# EAGLE design cartemoteur (EAGLE 7.6.0)
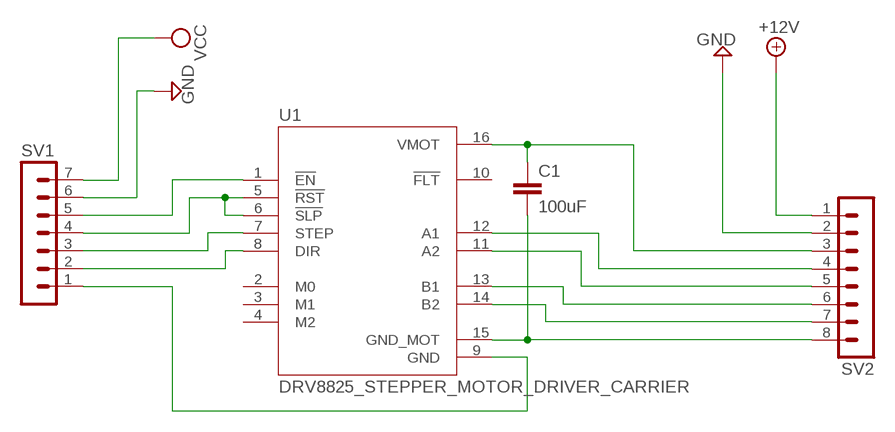
[diagram p0: schematic, sheet 1]

## Parts
C1  100uF  C-EU025-024X044  [C025-024X044]
SV1  MA07-1  [MA07-1]
SV2  MA08-1  [MA08-1]
U1  DRV8825_STEPPER_MOTOR_DRIVER_CARRIER  [IC_DRV8825_STEPPER_MOTOR_DRIVER_CARRIER]

## Nets
+12V: SV2.1
GND: SV1.6 SV2.2
N$1: SV1.5 U1.1(!EN)
N$2: SV1.4 U1.5(!RST) U1.6(!SLP)
N$3: SV1.3 U1.7(STEP)
N$4: SV1.2 U1.8(DIR)
N$5: SV1.1 U1.9(GND)
N$6: C1.2 SV2.8 U1.15(GND_MOT)
N$7: SV2.7 U1.14(B2)
N$8: SV2.6 U1.13(B1)
N$9: SV2.5 U1.11(A2)
N$10: SV2.4 U1.12(A1)
N$11: C1.1 SV2.3 U1.16(VMOT)
VCC: SV1.7
Unconnected: U1.2(M0) U1.3(M1) U1.4(M2) U1.10(!FLT)

## Library data of the parts
C1 = rcl:C-EU: CAPACITOR, European symbol
SV1 = con-lstb:MA07-1: PIN HEADER; OC_FARNELL: unknown; OC_NEWARK: unknown
SV2 = con-lstb:MA08-1: PIN HEADER; OC_FARNELL: unknown; OC_NEWARK: unknown
U1 = DRV8825_STEPPER_MOTOR_DRIVER_CARRIER:DRV8825_STEPPER_MOTOR_DRIVER_CARRIER: Stepper motor controler; IC: DRV8825; 1.5A; Uin mot: 8.2÷45V; AVAILABILITY: Unavailable; DESCRIPTION: DRV8825 Motor Controller/Driver Power Management Evaluation Board; MF: Pololu; MP: DRV8825 STEPPER MOTOR DRIVER CARRIER; PACKAGE: None; PRICE: None

## Board
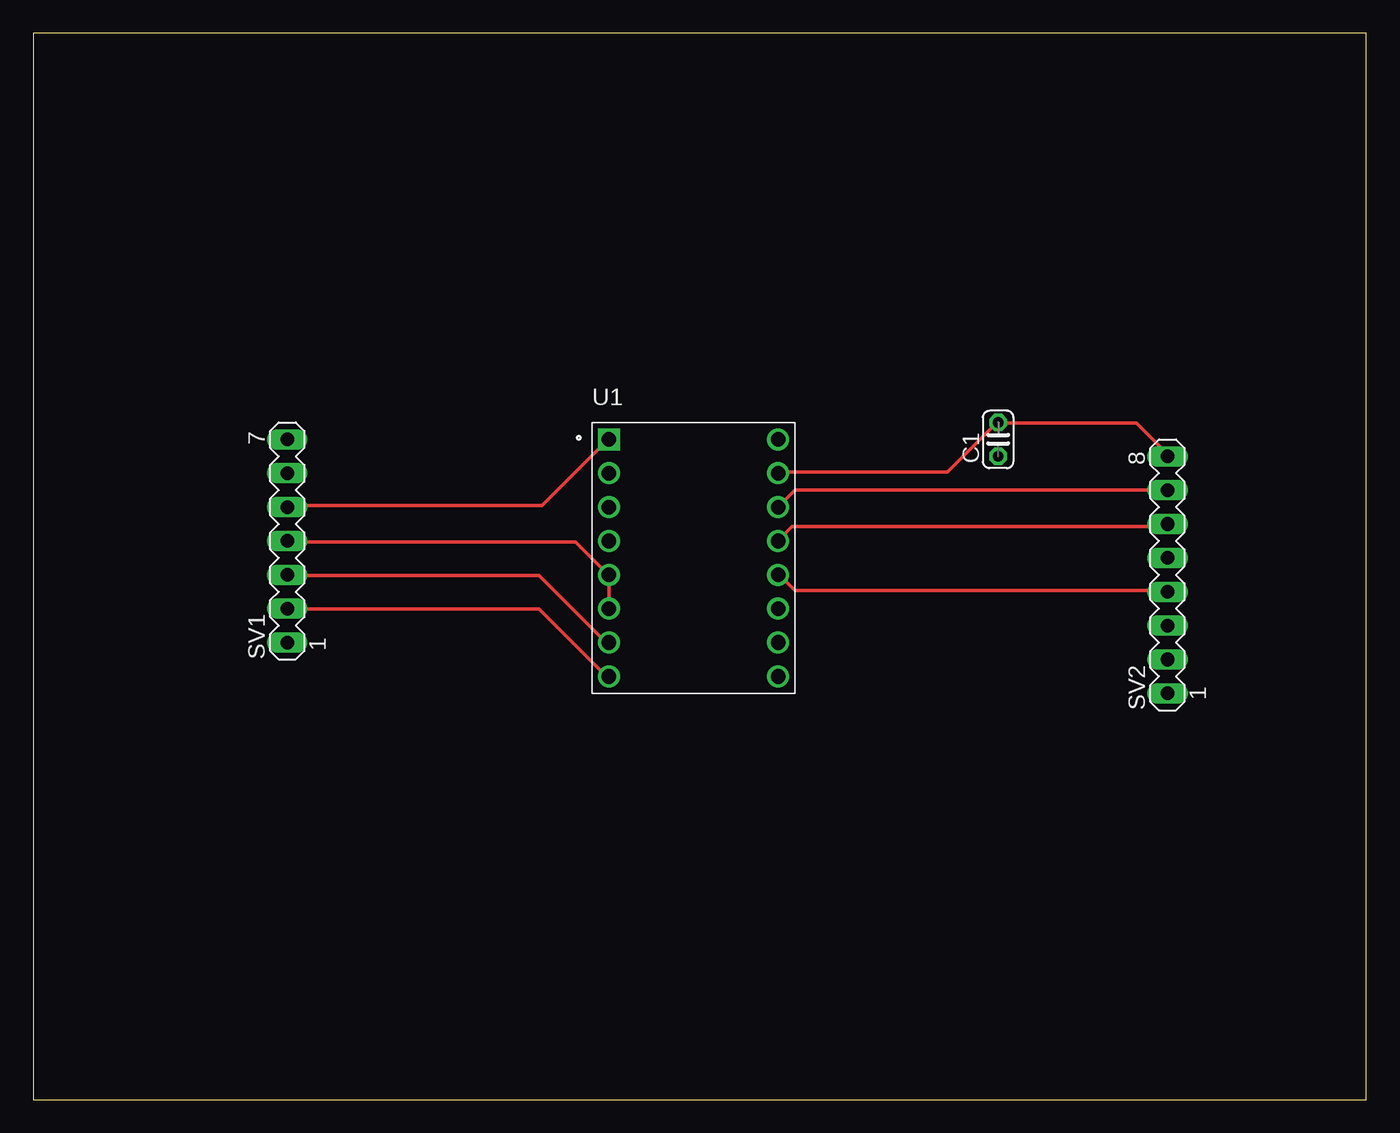
[diagram p1: board, top side]
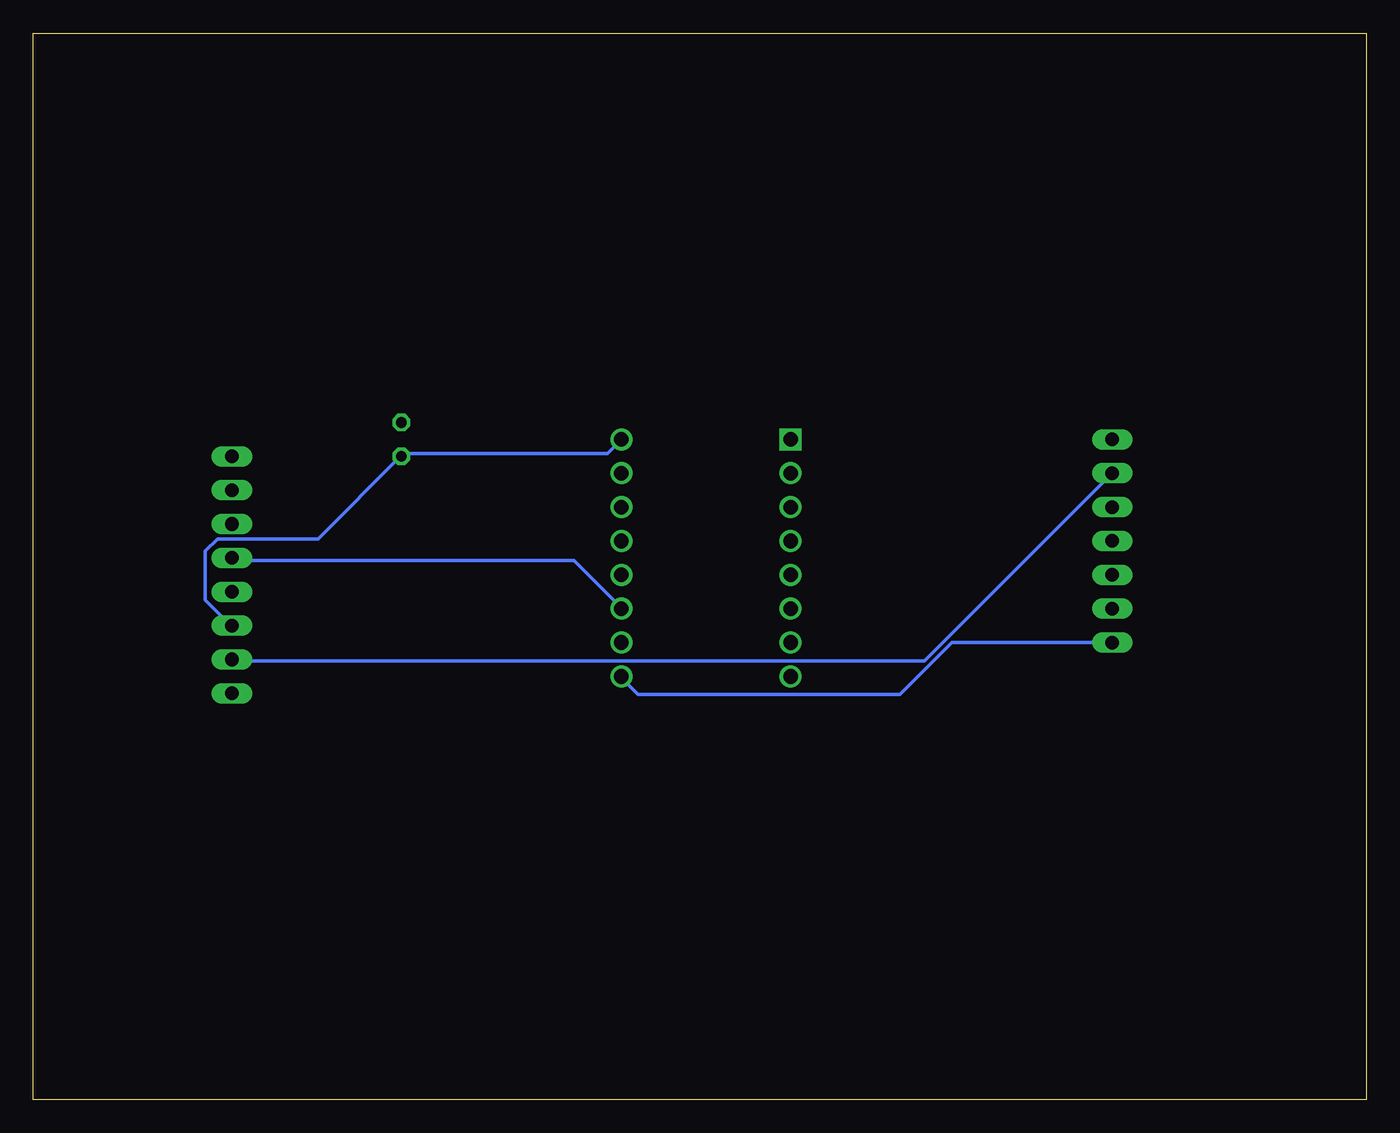
[diagram p2: board, bottom side, seen from below]

Size 100 x 80 mm. Coordinates in mm from the lower left corner, seen from the top.
Outline: 0,0 100,0 100,80 0,80 0,0
Copper layers (1*16): Top 0.035mm / dielectric 1.5mm / Bottom 0.035mm
Design rules "default": minimum track width 10mil, minimum drill 24mil, track to track 8mil, track to pad 8mil, pad to pad 8mil, via to via 8mil, smd to smd 8mil, copper to edge 40mil, drill to drill 8mil, minimum pad ring 10mil, minimum via ring 8mil, stop-mask expansion 4mil, vias tented up to drill 0mil, thermal gap 10mil

### Footprints (pad centres in the part's own frame; a part is rotated, then mirrored left to right if it is on the bottom)
C025-024X044 = drill 0.813 octagon: 1 -1.27,0; 2 1.27,0
MA07-1 = drill 1.016 long: 1 -7.62,0; 2 -5.08,0; 3 -2.54,0; 4 0,0; 5 2.54,0; 6 5.08,0; 7 7.62,0
MA08-1 = drill 1.016 long: 1 -8.89,0; 2 -6.35,0; 3 -3.81,0; 4 -1.27,0; 5 1.27,0; 6 3.81,0; 7 6.35,0; 8 8.89,0
IC_DRV8825_STEPPER_MOTOR_DRIVER_CARRIER = drill 1.1 square: 1 -6.35,8.89 | drill 1.1: 2 -6.35,6.35; 3 -6.35,3.81; 4 -6.35,1.27; 5 -6.35,-1.27; 6 -6.35,-3.81; 7 -6.35,-6.35; 8 -6.35,-8.89; 9 6.35,-8.89; 10 6.35,-6.35; 11 6.35,-3.81; 12 6.35,-1.27; 13 6.35,1.27; 14 6.35,3.81; 15 6.35,6.35; 16 6.35,8.89

### Placement (x,y rotation side)
C1  72.39,49.53 90 top
SV1  19.05,41.91 90 top
SV2  85.09,39.37 90 top
U1  49.53,40.64 0 top

### Tracks (layer width: path | path; a pad name or v marks a point on that pad's centre or on a via)
GND
  Bottom 0.254: SV2.2 85.04,32.92 33.15,32.92 19.2,46.86 SV1.6
N$1
  Top 0.254: SV1.5 19.2,44.58 38.18,44.58 42.98,49.38 U1.1
N$2
  Top 0.254: SV1.4 19.2,41.83 40.69,41.83 42.98,39.55 U1.5 43.2,39.32 43.2,37.03 U1.6
N$3
  Top 0.254: SV1.3 19.2,39.32 37.95,39.32 42.98,34.29 U1.7
N$4
  Top 0.254: SV1.2 19.2,36.8 37.95,36.8 42.98,31.77 U1.8
N$5
  Bottom 0.254: SV1.1 31.09,34.29 34.98,30.4 54.63,30.4 55.78,31.55 U1.9
N$6
  Top 0.254: SV2.8 85.04,48.46 82.75,50.75 72.47,50.75 C1.2 72.24,50.75 68.58,47.09 56.01,47.09 U1.15
N$7
  Top 0.254: SV2.7 57.15,45.72 U1.14
N$8
  Top 0.254: SV2.6 85.04,42.98 56.92,42.98 56.01,42.06 U1.13
N$9
  Bottom 0.254: SV2.5 85.04,40.46 59.44,40.46 56.01,37.03 U1.11
N$10
  Top 0.254: SV2.4 85.04,38.18 57.15,38.18 56.01,39.32 U1.12
N$11
  Bottom 0.254: U1.16 56.01,49.38 56.92,48.46 72.24,48.46 C1.1 72.47,48.23 78.64,42.06 86.18,42.06 87.1,41.15 87.1,37.49 85.27,35.66 SV2.3